# Altium schematic sheet SMT 2inch printer_060903.SchDoc: SMT 2inch printer
size A3
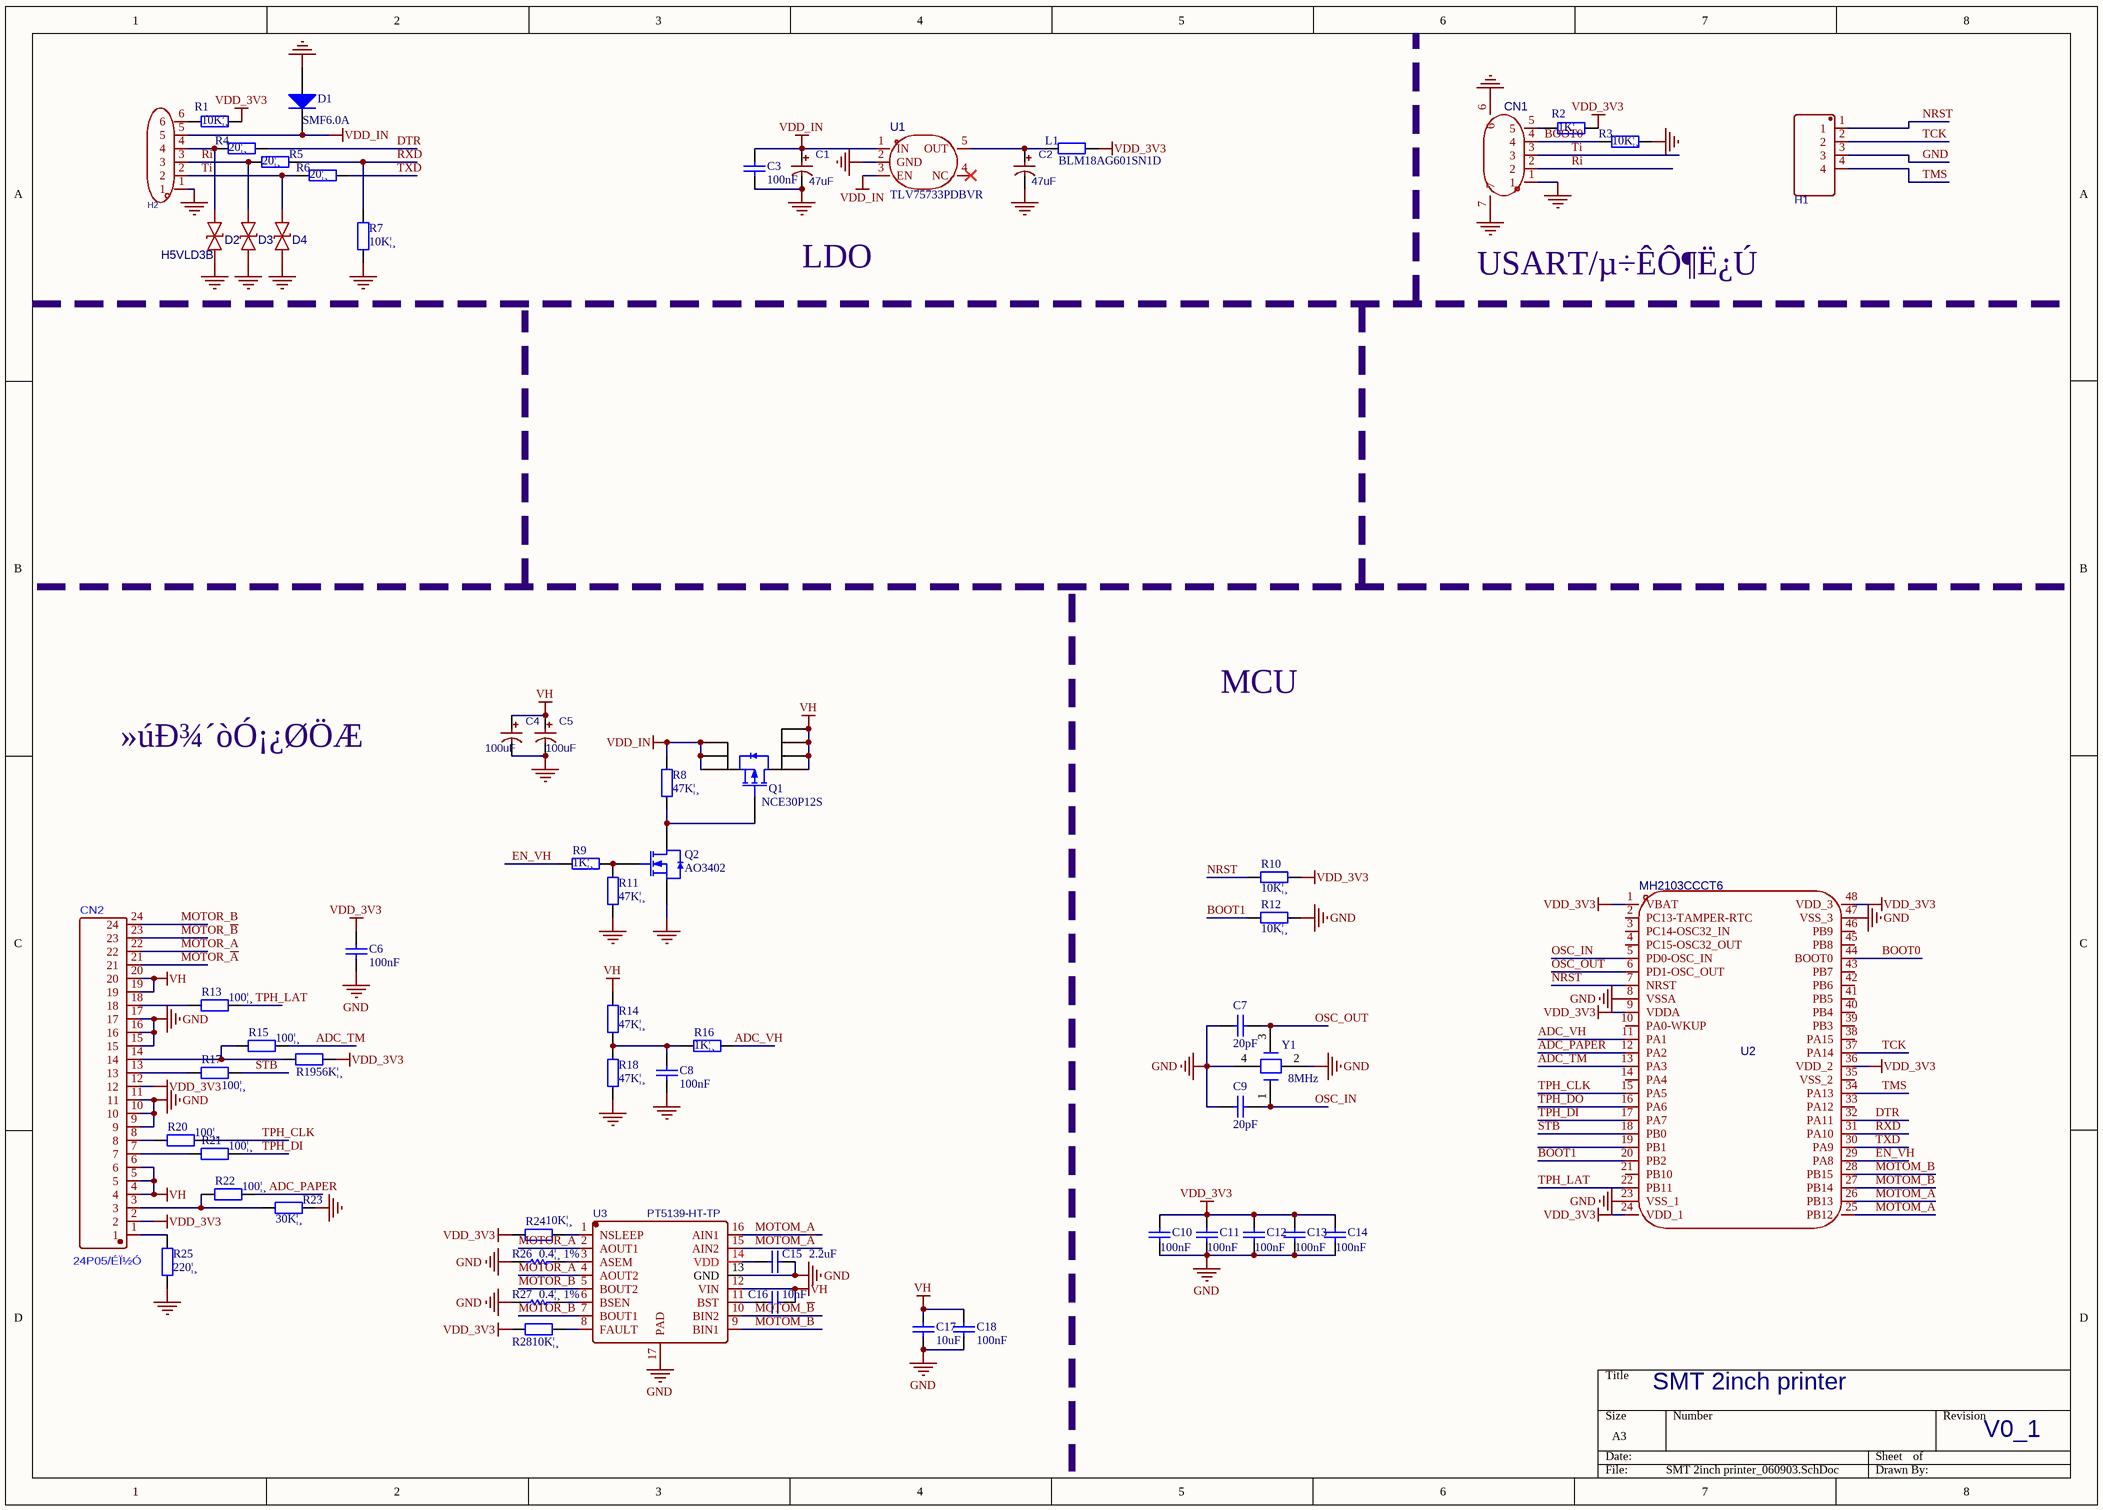
[diagram p0: SMT 2inch printer_060903.SchDoc]

## Parts
C1  47uF  [CAP-SMD_BD6.3-L6.6-W6.6-FD]
C2  47uF  [CAP-SMD_BD6.3-L6.6-W6.6-FD]
C3  100nF  [0603_C]
C4  100uF  [CAP-SMD_BD6.3-L6.6-W6.6-FD]
C5  100uF  [CAP-SMD_BD6.3-L6.6-W6.6-FD]
C6  100nF  [0603_C]
C7  20pF  [0603_C]
C8  100nF  [0603_C]
C9  20pF  [0603_C]
C10  100nF  [0603_C]
C11  100nF  [0603_C]
C12  100nF  [0603_C]
C13  100nF  [0603_C]
C14  100nF  [0603_C]
C15  2.2uF  [0603_C]
C16  10nF  [0603_C]
C17  10uF  [0603_C]
C18  100nF  [0603_C]
CN1  mx1.25mm-5p-wt  [CONN-SMD_5P-P1.25_MX1.25MM-5P-WT]  (value not drawn)
CN2  24P05/ÉÏ½Ó  [FPC-SMD_24P-P0.50_F0500WR-S-24PNLNG1GB0R]
D1  SMF6.0A  [SOD-123FL_L2.7-W1.8-LS3.8-RD]
D2  H5VLD3B  [SOD-323_L1.7-W1.3-LS2.5-BI]
D3  H5VLD3B  [SOD-323_L1.7-W1.3-LS2.5-BI]  (value not drawn)
D4  H5VLD3B  [SOD-323_L1.7-W1.3-LS2.5-BI]  (value not drawn)
H1  77311-462K05LF  [77311-462K05LF]  (value not drawn)
H2  lail-pz2.54-6p-l  [HDR-TH_6P-P2.54-V-F]  (value not drawn)
L1  BLM18AG601SN1D  [0805_L]
Q1  NCE30P12S  [SOIC-8_150mil]
Q2  AO3402  [SOT-23-3L]
R1  10K¦¸  [0603_R]
R2  1K¦¸  [0603_R]
R3  10K¦¸  [0603_R]
R4  20¦¸  [0603_R]
R5  20¦¸  [0603_R]
R6  20¦¸  [0603_R]
R7  10K¦¸  [0603_R]
R8  47K¦¸  [0603_R]
R9  1K¦¸  [0603_R]
R10  10K¦¸  [0603_R]
R11  47K¦¸  [0603_R]
R12  10K¦¸  [0603_R]
R13  100¦¸  [0603_R]
R14  47K¦¸  [0603_R]
R15  100¦¸  [0603_R]
R16  1K¦¸  [0603_R]
R17  100¦¸  [0603_R]
R18  47K¦¸  [0603_R]
R19  56K¦¸  [0603_R]
R20  100¦¸  [0603_R]
R21  100¦¸  [0603_R]
R22  100¦¸  [0603_R]
R23  30K¦¸  [0603_R]
R24  10K¦¸  [0603_R]
R25  220¦¸  [0603_R]
R26  0.4¦¸ 1%  [1206_R]
R27  0.4¦¸ 1%  [1206_R]
R28  10K¦¸  [0603_R]
U1  TLV75733PDBVR  [SOT-23-5]
U2  MH2103CCCT6  [LQFP-48_L7.0-W7.0-P0.50-LS9.0-BL]
U3  PT5139-HT-TP  [HTSSOP-16_L5.0-W4.4-P0.65-LS6.4-BL-EP]
Y1  8MHz  [XT_3225_4]

## Nets
GND: C1.2 C2.2 C3.2 C4.2 C5.2 C6.1 C7.1 C8.1 C9.1 C10.1 C11.1 C12.1 C13.1 C14.1 C15.2 C17.1 C18.1 CN1.1 CN1.6 CN1.7 CN2.9 CN2.10 CN2.11 CN2.15 CN2.16 CN2.17 D1.1(A) D2.1 D3.1 D4.1 H1.3 H2.1 Q2.2(S) R3.2 R7.1 R11.2 R12.1 R18.2 R23.2 R25.1 R26.2 R27.2 U1.2(GND) U2.8(VSSA) U2.23(VSS_1) U2.47(VSS_3) U3.13(GND) U3.17(PAD) Y1.2 Y1.4
VDD_3V3: C6.2 C10.2 C11.2 C12.2 C13.2 C14.2 CN2.2 CN2.12 L1.2 R1.2 R2.2 R10.1 R19.2 R24.2 R28.2 U2.1(VBAT) U2.9(VDDA) U2.24(VDD_1) U2.36(VDD_2) U2.48(VDD_3)
VDD_IN: C1.1 C3.1 D1.2(K) H2.5 Q1.1(S) Q1.2(S) Q1.3(S) R8.2 U1.1(IN) U1.3(EN)
VH: C4.1 C5.1 C16.2 C17.2 C18.2 CN2.4 CN2.5 CN2.6 CN2.19 CN2.20 Q1.5(D) Q1.6(D) Q1.7(D) Q1.8(D) R14.1 U3.12(VIN)
ADC_PAPER: R22.2 U2.12(PA2)
ADC_TM: R15.2 U2.13(PA3)
ADC_VH: R16.1 U2.11(PA1)
BOOT0: CN1.4 R3.1 U2.44(BOOT0)
BOOT1: R12.2 U2.20(PB2)
DTR: R4.2 U2.32(PA11)
EN_VH: R9.2 U2.29(PA8)
MOTOM_A: U2.25(PB12) U3.16(AIN1)
MOTOM_~{A}: U2.26(PB13) U3.15(AIN2)
MOTOM_B: U2.28(PB15) U3.9(BIN1)
MOTOM_~{B}: U2.27(PB14) U3.10(BIN2)
MOTOR_A: CN2.22 U3.2(AOUT1)
MOTOR_~{A}: CN2.21 U3.4(AOUT2)
MOTOR_B: CN2.24 U3.7(BOUT1)
MOTOR_~{B}: CN2.23 U3.5(BOUT2)
NRST: H1.1 R10.2 U2.7(NRST)
OSC_IN: C9.2 U2.5(PD0-OSC_IN) Y1.1(OSC1)
OSC_OUT: C7.2 U2.6(PD1-OSC_OUT) Y1.3(OSC2)
Ri: CN1.2 D3.2 H2.3 R5.1
RXD: R5.2 R7.2 U2.31(PA10)
STB: R17.2 U2.18(PB0)
TCK: H1.2 U2.37(PA14)
Ti: CN1.3 D4.2 H2.2 R6.1
TMS: H1.4 U2.34(PA13)
TPH_CLK: R20.2 U2.15(PA5)
TPH_DI: R21.2 U2.17(PA7)
TPH_DO: U2.16(PA6)
TPH_LAT: R13.2 U2.22(PB11)
TXD: R6.2 U2.30(PA9)
NetC2_1: C2.1 L1.1 U1.5(OUT)
NetC8_2: C8.2 R14.2 R16.2 R18.1
NetC15_1: C15.1 U3.14(VDD)
NetC16_1: C16.1 U3.11(BST)
NetCN1_5: CN1.5 R2.1
NetCN2_1: CN2.1 R25.2
NetCN2_3: CN2.3 R22.1 R23.1
NetCN2_7: CN2.7 R21.1
NetCN2_8: CN2.8 R20.1
NetCN2_13: CN2.13 R17.1
NetCN2_14: CN2.14 R15.1 R19.1
NetCN2_18: CN2.18 R13.1
NetD2_2: D2.2 H2.4 R4.1
NetH2_6: H2.6 R1.1
NetQ1_4: Q1.4(G) Q2.3(D) R8.1
NetQ2_1: Q2.1(G) R9.1 R11.1
NetR24_1: R24.1 U3.1(NSLEEP)
NetR26_1: R26.1 U3.3(ASEM)
NetR27_1: R27.1 U3.6(BSEN)
NetR28_1: R28.1 U3.8(FAULT)

Not connected (* = marked no-connect by the designer): U1 4(NC)*; U2 2(PC13-TAMPER-RTC) 3(PC14-OSC32_IN) 4(PC15-OSC32_OUT) 10(PA0-WKUP) 14(PA4) 19(PB1) 21(PB10) 33(PA12) 35(VSS_2) 38(PA15) 39(PB3) 40(PB4) 41(PB5) 42(PB6) 43(PB7) 45(PB8) 46(PB9)

## Notes on the sheet
- LDO
- (near CN1) USART/µ÷ÊÔ¶Ë¿Ú
- MCU
- »úÐ¾´òÓ¡¿ØÖÆ
- SMT 2inch printer
- V0_1

## Library data of the parts
C1 C2 C4 C5 = 10uF: BOM_Manufacturer: ValuePro; BOM_Manufacturer Part: 10uF 25V RHOS; nameAlias: Capacitance; BOM_Supplier: LCSC; BOM_Supplier Part: C19576; spicePre: C; spiceSymbolName: 10uF 25V RHOS
C3 C6 C8 C10-C14 C18 = 0603 100nF (104) 10% 50V: ÌùÆ¬µçÈÝ; ComponentLink1Description: ¹©Ó¦ÉÌÁ´½Ó; ComponentLink1URL: http://www.szlcsc.com/product/details_15331.html; Package: 0603; Supplier: LC; SuppliersPartNumber: C14663
C7 C9 = 0603 10pF (100) 5% 50V: ÌùÆ¬µçÈÝ; ComponentLink1Description: ¹©Ó¦ÉÌÁ´½Ó; ComponentLink1URL: http://www.szlcsc.com/product/details_1986.html; Package: 0603; Supplier: LC; SuppliersPartNumber: C1634
C15 = 0805 2.2uF (225) 20% 50V: ÌùÆ¬µçÈÝ; ComponentLink1Description: ¹©Ó¦ÉÌÁ´½Ó; ComponentLink1URL: http://www.szlcsc.com/product/details_50225.html; Package: 0805; Supplier: LC; SuppliersPartNumber: C49217
C16 = 0603 10nF (103) 10% 50V: ÌùÆ¬µçÈÝ; ComponentLink1Description: ¹©Ó¦ÉÌÁ´½Ó; ComponentLink1URL: http://www.szlcsc.com/product/details_58143.html; Package: 0603; Supplier: LC; SuppliersPartNumber: C57112
C17 = 0805 10uF (106) 10% 25V: ÌùÆ¬µçÈÝ; ComponentLink1Description: ¹©Ó¦ÉÌÁ´½Ó; ComponentLink1URL: http://www.szlcsc.com/product/details_16532.html; Package: 0805; Supplier: LC; SuppliersPartNumber: C15850
CN1 = mx1.25mm-5p-wt: AddInBom: yes; Pins Structure: 1x5P; Pitch: 1.25mm; Reference Series: PicoBlade(MX 1.25); Number of PINs Per Row: 5; Current Rating: 1A; Voltage Rating: 125V; Plastic Material: LCP; Symbol: MX1.25MM-5P-WT; SupplierPart: C53055351; ManufacturerPart: MX1.25mm-5P-WT; JLCPCB Part Class: Extended Part; Datasheet: https://item.szlcsc.com/datasheet/MX1.25mm-5P-WT/55999551.html; Supplier: LCSC; ConvertToPcb: yes; FootprintName: CONN-SMD_5P-P1.25_MX1.25MM-5P-WT; Number of Pins: 5P; Number of Rows: 1
D1 = SOD-323 1N4148WS T4: ÎÈÑ¹¶þ¼«¹Ü; ComponentLink1Description: ¹©Ó¦ÉÌÁ´½Ó; ComponentLink1URL: http://www.szlcsc.com/product/details_2485.html; Package: SOD-323; Supplier: LC; SuppliersPartNumber: C2128
D2-D4 = PESD5V0S1BA_C2827694: Symbol: PESD5V0S1BA_C2827694
H1 = 77311-462K05LF: BOM_Manufacturer: Amphenol ICC; Contributor: LCSC; BOM_Supplier: LCSC; BOM_Supplier Part: C180219; BOM_Manufacturer Part: 77311-462K05LF; spicePre: H; spiceSymbolName: 77311-462K05LF
H2 = lail-pz2.54-6p-l: AddInBom: yes; ModelId: 78d66b34ad7c4f8faa1ccf54151694d8; ModelName: CONN-TH_LAIL-PZ2.54-6P-L; ModelTransform: 599.999,98.8187,0,0,0,0,0,0,-118.11; Pin Structure: 1x6P; Pitch: 2.54mm; Current Rating: 3A; Voltage Rating (Max): 250V; SupplierPart: C54950607; ManufacturerPart: LAIL-PZ2.54-6P-L; JLCPCB Part Class: Extended Part; Datasheet: https://item.szlcsc.com/datasheet/LAIL-PZ2.54-6P-L/58519960.html; Supplier: LCSC; ConvertToPcb: yes; SymbolName: LAIL-PZ2.54-6P-L; FootprintName: CONN-TH_LAIL-PZ2.54-6P-L; Number of Pins: 6P; Insulation Height: 2.5mm; Length of End Connection Pin: 3mm
L1 R1-R3 R7 R10-R12 R14 R18 = 0603 4.7K¦¸ (4701) 1%: ÌùÆ¬µç×è; ComponentLink1Description: ¹©Ó¦ÉÌÁ´½Ó; ComponentLink1URL: http://www.szlcsc.com/product/details_23889.html; Package: 0603; Supplier: LC; SuppliersPartNumber: C23162
Q1 = AO4407A: MOS(³¡Ð§Ó¦¹Ü); ComponentLink1Description: ¹©Ó¦ÉÌÁ´½Ó; ComponentLink1URL: http://www.szlcsc.com/product/details_16754.html; Package: SOIC-8_150mil; Supplier: LC; SuppliersPartNumber: C16072
Q2 = AO3402A NµÀ¹µ X0YV1T SOT-23: MOS(³¡Ð§Ó¦¹Ü); ComponentLink1Description: ¹©Ó¦ÉÌÁ´½Ó; ComponentLink1URL: http://www.szlcsc.com/product/details_21629.html; Package: SOT-23; Supplier: LC; SuppliersPartNumber: C20917
R4-R6 = 0603 100¦¸ (1000) 1%: ÌùÆ¬µç×è; ComponentLink1Description: ¹©Ó¦ÉÌÁ´½Ó; ComponentLink1URL: http://www.szlcsc.com/product/details_23502.html; Package: 0603; Supplier: LC; SuppliersPartNumber: C22775
R8 = 0603 47K¦¸ (4702) 1%: ÌùÆ¬µç×è; ComponentLink1Description: ¹©Ó¦ÉÌÁ´½Ó; ComponentLink1URL: http://www.szlcsc.com/product/details_26562.html; Package: 0603; Supplier: LC; SuppliersPartNumber: C25819
R9 R16 = 0603 470¦¸ (4700) 1%: ÌùÆ¬µç×è; ComponentLink1Description: ¹©Ó¦ÉÌÁ´½Ó; ComponentLink1URL: http://www.szlcsc.com/product/details_23906.html; Package: 0603; Supplier: LC; SuppliersPartNumber: C23179
R13 R15 R17 R19-R22 R24 R28 = 0603 10K¦¸ (1002) 1%: ÌùÆ¬µç×è; ComponentLink1Description: ¹©Ó¦ÉÌÁ´½Ó; ComponentLink1URL: http://www.szlcsc.com/product/details_26547.html; Package: 0603; Supplier: LC; SuppliersPartNumber: C25804
R23 = 0603 30K¦¸ (3002) 1%: ÌùÆ¬µç×è; ComponentLink1Description: ¹©Ó¦ÉÌÁ´½Ó; ComponentLink1URL: http://www.szlcsc.com/product/details_23711.html; Package: 0603; Supplier: LC; SuppliersPartNumber: C22984
R25 = 0603 200¦¸ (2000) 1%: ÌùÆ¬µç×è; ComponentLink1Description: ¹©Ó¦ÉÌÁ´½Ó; ComponentLink1URL: http://www.szlcsc.com/product/details_8708.html; Package: 0603; Supplier: LC; SuppliersPartNumber: C8218
R26 R27 = Res: Resistor; Value: 1K; Published: 8-Jun-2000; LatestRevisionDate: 17-Jul-2002; LatestRevisionNote: Re-released for DXP Platform.; PackageReference: 0603; Publisher: Altium Limited; PackageDescription: Axial Device, Thru-Hole; 2 Leads; 0.3 in Pin Spacing
U2 = stm32f103c8t6: AddInBom: yes; ModelId: 093be70396ff421eb2cdb946d5311efc; ModelName: LQFP-48_L7.0-W7.0-H1.4-LS9.0-P0.50; ModelTransform: 354.331,354.331,0,0,0,0,0,0,0; CPU Core: ARM Cortex-M3; CPU Maximum Speed: 72MHz; Core Size: 32 Bit; Program Storage Size: 64KB; Program Memory Type: FLASH; RAM Size: 20KB; Number of I/O: 37; ADC (Bit): 12bit; Voltage - Supply: 2V~3.6V; Symbol: STM32F103C8T6; SupplierPart: C8734; ManufacturerPart: STM32F103C8T6; Supplier Footprint: LQFP-48(7x7); JLCPCB Part Class: Extended Part; Datasheet: https://item.szlcsc.com/datasheet/STM32F103C8T6/9243.html; Supplier: LCSC; ConvertToPcb: yes; FootprintName: LQFP-48_L7.0-W7.0-P0.50-LS9.0-BL; EEPROM: -
U3 = PT5139-HT-TP: BOM_Manufacturer: Princeton Tech; Contributor: LCSC; BOM_Supplier: LCSC; BOM_Supplier Part: C336601; BOM_Manufacturer Part: PT5139-HT-TP; spicePre: U; spiceSymbolName: PT5139-HT-TP
Y1 = XTAL_4: Crystal Oscillator
U1 = TLV75733PDBVR: Symbol: TLV75733PDBVR